# Altium schematic sheet MCU.SchDoc: MCU
size A4; SheetNumber: 4; SheetTotal: 6
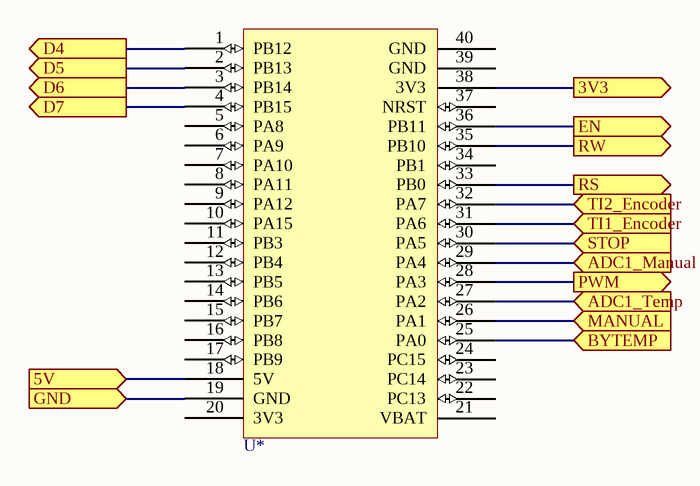
[diagram p0: MCU.SchDoc]

## Parts
U*  STM32 BluePill  [STM32 Bluepill]  (value not drawn)

## Ports
3V3 (out), 5V (in), ADC1_Manual (in), ADC1_Temp (in), BYTEMP (in), D4 (out), D5 (out), D6 (out), D7 (out), EN (out), GND (in), MANUAL (in), PWM (out), RS (out), RW (out), STOP (in), TI1_Encoder (in), TI2_Encoder (in)

## Nets
3V3: U*.38(3V3) ; port 3V3
5V: U*.18(5V) ; port 5V
ADC1_Manual: U*.29(PA4) ; port ADC1_Manual
ADC1_Temp: U*.27(PA2) ; port ADC1_Temp
BYTEMP: U*.25(PA0) ; port BYTEMP
D4: U*.1(PB12) ; port D4
D5: U*.2(PB13) ; port D5
D6: U*.3(PB14) ; port D6
D7: U*.4(PB15) ; port D7
EN: U*.36(PB11) ; port EN
GND: U*.19(GND) ; port GND
MANUAL: U*.26(PA1) ; port MANUAL
PWM: U*.28(PA3) ; port PWM
RS: U*.33(PB0) ; port RS
RW: U*.35(PB10) ; port RW
STOP: U*.30(PA5) ; port STOP
TI1_Encoder: U*.31(PA6) ; port TI1_Encoder
TI2_Encoder: U*.32(PA7) ; port TI2_Encoder

Not connected (* = marked no-connect by the designer): U* 5(PA8) 6(PA9) 7(PA10) 8(PA11) 9(PA12) 10(PA15) 11(PB3) 12(PB4) 13(PB5) 14(PB6) 15(PB7) 16(PB8) 17(PB9) 20(3V3) 21(VBAT) 22(PC13) 23(PC14) 24(PC15) 34(PB1) 37(NRST) 39(GND) 40(GND)

## Notes on the sheet
- Document Title:
- ĐH BKHN
- Project Name:
- Size:
- A4
- Reviewer:
- Designer:
- Nguyen Ba Hoang
- Revision:
- 1 Dai Co Viet Street
- Bach Khoa, Hai Ba Trung
- Ha Noi
- File:
- Sheet:
- of
- Date:

## Library data of the parts
U* = STM32 BluePill: Available: *